# Altium schematic sheet Kinen Expansion Channel.SchDoc
size A
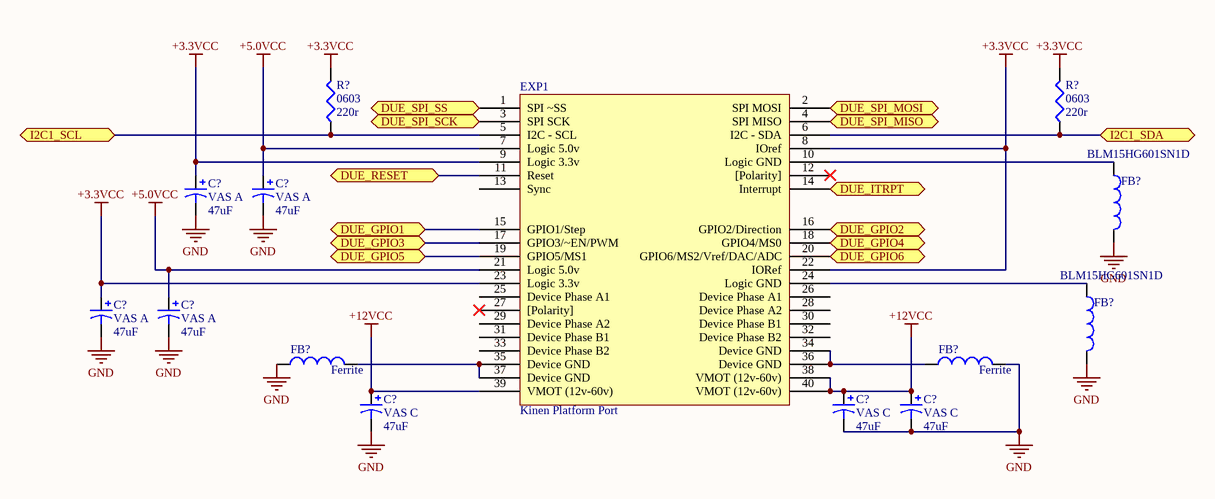
[diagram p0: Kinen Expansion Channel.SchDoc]

## Parts
(Parts that share a designator on the sheet are numbered #1, #2 ... from top to bottom, then left to right.)
C?#1  VAS A  value 47uF  [Panasonic VS A]
C?#2  VAS A  value 47uF  [Panasonic VS A]
C?#3  VAS A  value 47uF  [Panasonic VS A]
C?#4  VAS A  value 47uF  [Panasonic VS A]
C?#5  VAS C  value 47uF  [Panasonic VS C]
C?#6  VAS C  value 47uF  [Panasonic VS C]
C?#7  VAS C  value 47uF  [Panasonic VS C]
EXP1  Kinen Platform Port  [Kinen Port]
FB?#1  BLM15HG601SN1D  [BLM18PG121SN1D]
FB?#2  BLM15HG601SN1D  [BLM18PG121SN1D]
FB?#3  Ferrite  [SM 0805 - gap trimmed]
FB?#4  Ferrite  [SM 0805 - gap trimmed]
R?#1  0603  value 220r  [J1-0603]
R?#2  0603  value 220r  [J1-0603]

## Ports
DUE_GPIO1, DUE_GPIO2, DUE_GPIO3, DUE_GPIO4, DUE_GPIO5, DUE_GPIO6, DUE_ITRPT, DUE_RESET, DUE_SPI_MISO, DUE_SPI_MOSI, DUE_SPI_SCK, DUE_SPI_SS, I2C1_SCL, I2C1_SDA

## Nets
+3.3VCC: C?#1.1 C?#3.1 EXP1.8(IOref) EXP1.9(Logic_3.3v) EXP1.22(IORef) EXP1.23(Logic_3.3v) R?#1.2 R?#2.2
+5.0VCC: C?#2.1 C?#4.1 EXP1.7(Logic_5.0v) EXP1.21(Logic_5.0v)
+12VCC: C?#5.1 C?#6.1 C?#7.1 EXP1.38(VMOT_(12v-60v)) EXP1.39(VMOT_(12v-60v)) EXP1.40(VMOT_(12v-60v))
GND: C?#1.2 C?#2.2 C?#3.2 C?#4.2 C?#5.2 C?#6.2 C?#7.2 FB?#1.2 FB?#2.2 FB?#3.1 FB?#4.2
DUE_GPIO1: EXP1.15(GPIO1/Step) ; port DUE_GPIO1
DUE_GPIO2: EXP1.16(GPIO2/Direction) ; port DUE_GPIO2
DUE_GPIO3: EXP1.17(GPIO3/~EN/PWM) ; port DUE_GPIO3
DUE_GPIO4: EXP1.18(GPIO4/MS0) ; port DUE_GPIO4
DUE_GPIO5: EXP1.19(GPIO5/MS1) ; port DUE_GPIO5
DUE_GPIO6: EXP1.20(GPIO6/MS2/Vref/DAC/ADC) ; port DUE_GPIO6
DUE_ITRPT: EXP1.14(Interrupt) ; port DUE_ITRPT
DUE_RESET: EXP1.11(Reset) ; port DUE_RESET
DUE_SPI_MISO: EXP1.4(SPI_MISO) ; port DUE_SPI_MISO
DUE_SPI_MOSI: EXP1.2(SPI_MOSI) ; port DUE_SPI_MOSI
DUE_SPI_SCK: EXP1.3(SPI_SCK) ; port DUE_SPI_SCK
DUE_SPI_SS: EXP1.1(SPI_~SS) ; port DUE_SPI_SS
I2C1_SCL: EXP1.5(I2C_-_SCL) R?#1.1 ; port I2C1_SCL
I2C1_SDA: EXP1.6(I2C_-_SDA) R?#2.1 ; port I2C1_SDA
NetEXP1_10: EXP1.10(Logic_GND) FB?#1.1
NetEXP1_24: EXP1.24(Logic_GND) FB?#2.1
NetEXP1_34: EXP1.34(Device_GND) EXP1.36(Device_GND) FB?#4.1
NetEXP1_35: EXP1.35(Device_GND) EXP1.37(Device_GND) FB?#3.2

Not connected (* = marked no-connect by the designer): EXP1 12([Polarity])* 13(Sync) 25(Device_Phase_A1) 26(Device_Phase_A1) 27([Polarity])* 28(Device_Phase_A2) 29(Device_Phase_A2) 30(Device_Phase_B1) 31(Device_Phase_B1) 32(Device_Phase_B2) 33(Device_Phase_B2)

## Library data of the parts
C?#1-C?#7 = Cap Pol3: Polarized Capacitor (Surface Mount); Published: 8-Jun-2000; LatestRevisionDate: 29-May-2009; LatestRevisionNote: IPC-7351 Footprint Added.; PackageReference: C0805; Publisher: Altium Limited; PackageDescription: Chip Capacitor
EXP1 = Kinen Port
FB?#1-FB?#4 = Inductor: Code_IEC: 1005; Published: 8-Jun-2000; LatestRevisionDate: 17-Jul-2002; LatestRevisionNote: Re-released for DXP Platform.; PackageReference: 0402-A; Publisher: Altium Limited; Code_JEITA: 0402
R?#1 R?#2 = Res3: Resistor; Published: 8-Jun-2000; LatestRevisionDate: 29-May-2009; LatestRevisionNote: IPC-7351 Footprint Added.; PackageReference: J1-0603; Publisher: Altium Limited; PackageDescription: Chip Resistor